# Altium schematic sheet 8 gate driver.SchDoc
size A4; DocumentNumber: 8; SheetNumber: 10; SheetTotal: 12
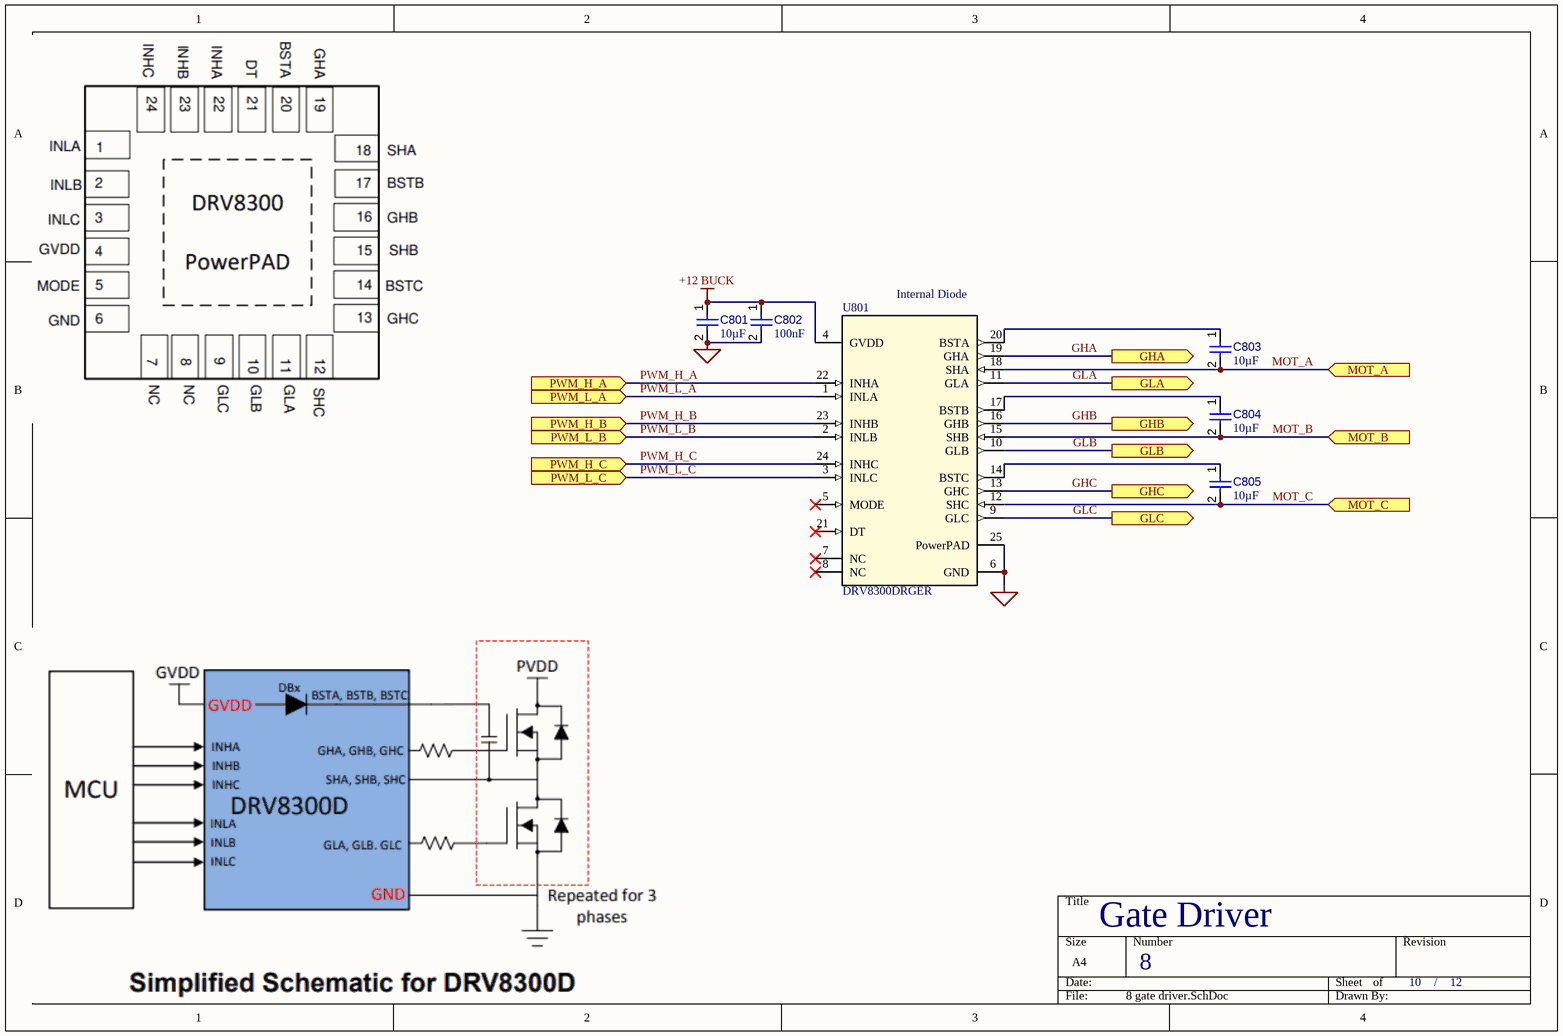
[diagram p0: 8 gate driver.SchDoc]

## Parts
C801  value 10µF  [CAPC0603(1608)100_L]  (hidden comment: Capacitor 10µF +/-20% 10V 0603)
C802  value 100nF  [CAPC0402(1005)60_L]  (hidden comment: Capacitor 100nF +/-20% 25V 0402)
C803  value 10µF  [CAPC0603(1608)100_L]  (hidden comment: Capacitor 10µF +/-20% 10V 0603)
C804  value 10µF  [CAPC0603(1608)100_L]  (hidden comment: Capacitor 10µF +/-20% 10V 0603)
C805  value 10µF  [CAPC0603(1608)100_L]  (hidden comment: Capacitor 10µF +/-20% 10V 0603)
U801  DRV8300DRGER  [RGE0024B-MFG]

## Ports
GHA (out), GHB (out), GHC (out), GLA (out), GLB (out), GLC (out), MOT_A (in), MOT_B (in), MOT_C (in), PWM_H_A (in), PWM_H_B (in), PWM_H_C (in), PWM_L_A (in), PWM_L_B (in), PWM_L_C (in)

## Nets
+12 BUCK: C801.1 C802.1 U801.4(GVDD)
PGND: C801.2 C802.2 U801.6(GND) U801.25(PowerPAD)
GHA: U801.19(GHA) ; port GHA
GHB: U801.16(GHB) ; port GHB
GHC: U801.13(GHC) ; port GHC
GLA: U801.11(GLA) ; port GLA
GLB: U801.10(GLB) ; port GLB
GLC: U801.9(GLC) ; port GLC
MOT_A: C803.2 U801.18(SHA) ; port MOT_A
MOT_B: C804.2 U801.15(SHB) ; port MOT_B
MOT_C: C805.2 U801.12(SHC) ; port MOT_C
PWM_H_A: U801.22(INHA) ; port PWM_H_A
PWM_H_B: U801.23(INHB) ; port PWM_H_B
PWM_H_C: U801.24(INHC) ; port PWM_H_C
PWM_L_A: U801.1(INLA) ; port PWM_L_A
PWM_L_B: U801.2(INLB) ; port PWM_L_B
PWM_L_C: U801.3(INLC) ; port PWM_L_C
NetC803_1: C803.1 U801.20(BSTA)
NetC804_1: C804.1 U801.17(BSTB)
NetC805_1: C805.1 U801.14(BSTC)

Not connected (* = marked no-connect by the designer): U801 5(MODE)* 7(NC)* 8(NC)* 21(DT)*

## Notes on the sheet
- (near U801) Internal Diode
- Gate Driver
- /

## Library data of the parts
C801 C803-C805 = CMP-001-00075-4: Chip Capacitor, 10µF +/-20%, 10V, 0603, Thickness 1 mm; Tolerance: 10%; Voltage Rating: 10V; Max Operating Temperature: 85°C; Pins: 2; Case/Package: 0603; Mounting Technology: SMT; Min Operating Temperature: -55°C
C802 = CMP-001-00065-4: Chip Capacitor, 100nF +/-20%, 25V, 0402, Thickness 0.6 mm; Tolerance: 10%; Max Operating Temperature: 85°C; Min Operating Temperature: -55°C; Pins: 2; Voltage Rating: 25V; Mounting Technology: SMT; Case/Package: 0402
U801 = DRV8300DRGER: No Description Available; Mfr_Name: Texas Instruments; TYPE: TYPE; RefDes: RefDes